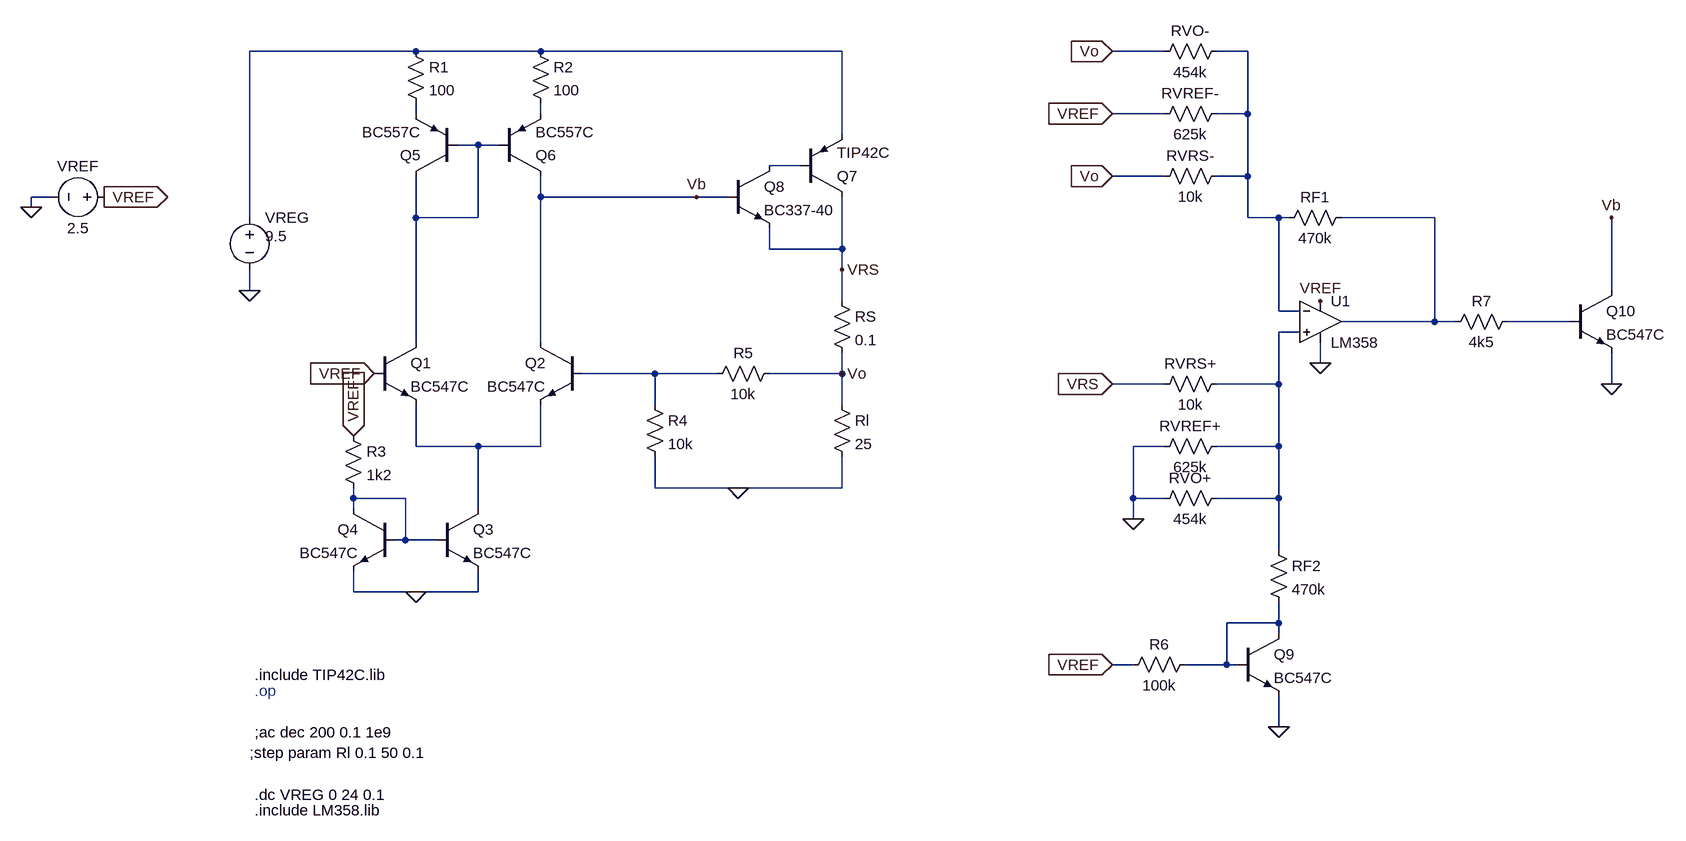
[diagram p0: schematic Circuito_foldback_final.asc]
Circuito_foldback_final.asc, the LTspice schematic file:
Version 4.1
SHEET 1 2132 1032
WIRE 208 -192 -48 -192
WIRE 400 -192 208 -192
WIRE 864 -192 400 -192
WIRE 1360 -192 1280 -192
WIRE 1488 -192 1440 -192
WIRE 208 -96 208 -112
WIRE 400 -96 400 -112
WIRE 1360 -96 1280 -96
WIRE 1488 -96 1488 -192
WIRE 1488 -96 1440 -96
WIRE 864 -64 864 -192
WIRE 304 -48 272 -48
WIRE 336 -48 304 -48
WIRE 800 -16 752 -16
WIRE 1360 0 1280 0
WIRE 1488 0 1488 -96
WIRE 1488 0 1440 0
WIRE -352 32 -384 32
WIRE 400 32 400 0
WIRE 640 32 400 32
WIRE 688 32 640 32
WIRE -384 48 -384 32
WIRE -48 64 -48 -192
WIRE 208 64 208 0
WIRE 304 64 304 -48
WIRE 304 64 208 64
WIRE 1488 64 1488 0
WIRE 1536 64 1488 64
WIRE 1552 64 1536 64
WIRE 1776 64 1632 64
WIRE 752 112 752 80
WIRE 864 112 864 32
WIRE 864 112 752 112
WIRE 864 144 864 112
WIRE -48 176 -48 144
WIRE 2048 176 2048 64
WIRE 864 192 864 144
WIRE 1536 208 1536 64
WIRE 1568 208 1536 208
WIRE 1776 224 1776 64
WIRE 1776 224 1632 224
WIRE 1808 224 1776 224
WIRE 1984 224 1888 224
WIRE 1568 240 1536 240
WIRE 208 256 208 64
WIRE 400 256 400 32
WIRE 1600 288 1600 256
WIRE 576 304 464 304
WIRE 672 304 576 304
WIRE 864 304 864 272
WIRE 864 304 752 304
WIRE 1360 320 1280 320
WIRE 1536 320 1536 240
WIRE 1536 320 1440 320
WIRE 2048 320 2048 272
WIRE 576 352 576 304
WIRE 864 352 864 304
WIRE 208 416 208 352
WIRE 304 416 208 416
WIRE 400 416 400 352
WIRE 400 416 304 416
WIRE 1360 416 1312 416
WIRE 1536 416 1536 320
WIRE 1536 416 1440 416
WIRE 576 480 576 432
WIRE 704 480 576 480
WIRE 864 480 864 432
WIRE 864 480 704 480
WIRE 112 496 112 480
WIRE 192 496 112 496
WIRE 1312 496 1312 416
WIRE 1360 496 1312 496
WIRE 1536 496 1536 416
WIRE 1536 496 1440 496
WIRE 112 512 112 496
WIRE 304 512 304 416
WIRE 1312 528 1312 496
WIRE 192 560 192 496
WIRE 192 560 176 560
WIRE 240 560 192 560
WIRE 1536 576 1536 496
WIRE 112 640 112 608
WIRE 208 640 112 640
WIRE 304 640 304 608
WIRE 304 640 208 640
WIRE 1536 688 1536 656
WIRE 1536 688 1456 688
WIRE 1536 704 1536 688
WIRE 1312 752 1280 752
WIRE 1456 752 1456 688
WIRE 1456 752 1392 752
WIRE 1472 752 1456 752
WIRE 1536 848 1536 800
FLAG -272 32 VREF
IOPIN -272 32 Out
FLAG -384 48 0
FLAG 144 304 VREF
IOPIN 144 304 In
FLAG 112 400 VREF
IOPIN 112 400 In
FLAG -48 176 0
FLAG 208 640 0
FLAG 704 480 0
FLAG 864 304 Vo
FLAG 640 32 Vb
FLAG 1280 -192 Vo
IOPIN 1280 -192 In
FLAG 1280 0 Vo
IOPIN 1280 0 In
FLAG 1280 -96 VREF
IOPIN 1280 -96 In
FLAG 1280 320 VRS
IOPIN 1280 320 In
FLAG 1312 528 0
FLAG 1536 848 0
FLAG 1280 752 VREF
IOPIN 1280 752 In
FLAG 864 144 VRS
FLAG 2048 320 0
FLAG 1600 192 VREF
FLAG 1600 288 0
FLAG 2048 64 Vb
SYMBOL voltage -48 48 R0
WINDOW 3 24 44 Left 2
WINDOW 123 0 0 Left 0
WINDOW 39 0 0 Left 0
SYMATTR Value 9.5
SYMATTR InstName VREG
SYMBOL npn 144 256 R0
SYMATTR InstName Q1
SYMATTR Value BC547C
SYMBOL npn 464 256 M0
SYMATTR InstName Q2
SYMATTR Value BC547C
SYMBOL res 560 336 R0
SYMATTR InstName R4
SYMATTR Value 10k
SYMBOL res 768 288 R90
WINDOW 0 0 56 VBottom 2
WINDOW 3 32 56 VTop 2
SYMATTR InstName R5
SYMATTR Value 10k
SYMBOL voltage -256 32 R90
WINDOW 0 -32 56 VBottom 2
WINDOW 3 32 56 VTop 2
WINDOW 123 0 0 Left 0
WINDOW 39 0 0 Left 0
SYMATTR InstName VREF
SYMATTR Value 2.5
SYMBOL npn 240 512 R0
SYMATTR InstName Q3
SYMATTR Value BC547C
SYMBOL npn 176 512 M0
SYMATTR InstName Q4
SYMATTR Value BC547C
SYMBOL res 96 384 R0
SYMATTR InstName R3
SYMATTR Value 1k2
SYMBOL pnp 272 0 R180
SYMATTR InstName Q5
SYMATTR Value BC557C
SYMBOL pnp 336 0 M180
SYMATTR InstName Q6
SYMATTR Value BC557C
SYMBOL pnp 800 32 M180
SYMATTR InstName Q7
SYMATTR Value TIP42C
SYMBOL npn 688 -16 R0
SYMATTR InstName Q8
SYMATTR Value BC337-40
SYMBOL res 848 176 R0
SYMATTR InstName RS
SYMATTR Value 0.1
SYMBOL res 848 336 R0
SYMATTR InstName Rl
SYMATTR Value 25
SYMBOL res 1456 -208 R90
WINDOW 0 0 56 VBottom 2
WINDOW 3 32 56 VTop 2
SYMATTR InstName RVO-
SYMATTR Value 454k
SYMBOL res 1456 -112 R90
WINDOW 0 0 56 VBottom 2
WINDOW 3 32 56 VTop 2
SYMATTR InstName RVREF-
SYMATTR Value 625k
SYMBOL res 1456 -16 R90
WINDOW 0 0 56 VBottom 2
WINDOW 3 32 56 VTop 2
SYMATTR InstName RVRS-
SYMATTR Value 10k
SYMBOL res 1648 48 R90
WINDOW 0 0 56 VBottom 2
WINDOW 3 32 56 VTop 2
SYMATTR InstName RF1
SYMATTR Value 470k
SYMBOL res 1456 304 R90
WINDOW 0 0 56 VBottom 2
WINDOW 3 32 56 VTop 2
SYMATTR InstName RVRS+
SYMATTR Value 10k
SYMBOL res 1456 400 R90
WINDOW 0 0 56 VBottom 2
WINDOW 3 32 56 VTop 2
SYMATTR InstName RVREF+
SYMATTR Value 625k
SYMBOL res 1456 480 R90
WINDOW 0 0 56 VBottom 2
WINDOW 3 32 56 VTop 2
SYMATTR InstName RVO+
SYMATTR Value 454k
SYMBOL res 1520 560 R0
SYMATTR InstName RF2
SYMATTR Value 470k
SYMBOL npn 1472 704 R0
SYMATTR InstName Q9
SYMATTR Value BC547C
SYMBOL res 1408 736 R90
WINDOW 0 0 56 VBottom 2
WINDOW 3 32 56 VTop 2
SYMATTR InstName R6
SYMATTR Value 100k
SYMBOL res 1904 208 R90
WINDOW 0 0 56 VBottom 2
WINDOW 3 32 56 VTop 2
SYMATTR InstName R7
SYMATTR Value 4k5
SYMBOL npn 1984 176 R0
SYMATTR InstName Q10
SYMATTR Value BC547C
SYMBOL OpAmps\\opamp2 1600 160 R0
SYMATTR InstName U1
SYMATTR Value LM358
SYMBOL res 192 -208 R0
SYMATTR InstName R1
SYMATTR Value 100
SYMBOL res 384 -208 R0
SYMATTR InstName R2
SYMATTR Value 100
TEXT -40 768 Left 2 !.include TIP42C.lib
TEXT -40 792 Left 2 ;.op
TEXT -48 888 Left 2 !;step param Rl 0.1 50 0.1
TEXT -40 976 Left 2 !.include LM358.lib
TEXT -40 856 Left 2 !;ac dec 200 0.1 1e9
TEXT -40 952 Left 2 !.dc VREG 0 24 0.1

The netlist it stands for:
* Circuito_foldback_final.asc
VREG N001 0 9.5
Q1 N005 VREF N011 0 BC547C
Q2 Vb N010 N011 0 BC547C
R4 N010 0 10k
R5 Vo N010 10k
VREF VREF 0 2.5
Q3 N011 N012 0 0 BC547C
Q4 N012 N012 0 0 BC547C
R3 VREF N012 1k2
Q5 N005 N005 N003 0 BC557C
Q6 Vb N005 N004 0 BC557C
Q7 VRS N006 N001 0 TIP42C
Q8 N006 Vb VRS 0 BC337-40
RS VRS Vo 0.1
Rl Vo 0 25
RVO- N002 Vo 454k
RVREF- N002 VREF 625k
RVRS- N002 Vo 10k
RF1 N007 N002 470k
RVRS+ N009 VRS 10k
RVREF+ N009 0 625k
RVO+ N009 0 454k
RF2 N009 N013 470k
Q9 N013 N013 0 0 BC547C
R6 N013 VREF 100k
R7 N008 N007 4k5
Q10 Vb N008 0 0 BC547C
X§U1 N009 N002 VREF 0 N007 LM358  ; pins In+ In- V+ V- OUT
R1 N001 N003 100
R2 N001 N004 100
.model NPN NPN
.model PNP PNP
.lib standard.bjt
.include TIP42C.lib
* .op
;step param Rl 0.1 50 0.1
.include LM358.lib
;ac dec 200 0.1 1e9
.dc VREG 0 24 0.1
.backanno
.end